# EAGLE design schematics (EAGLE 9.6.2)
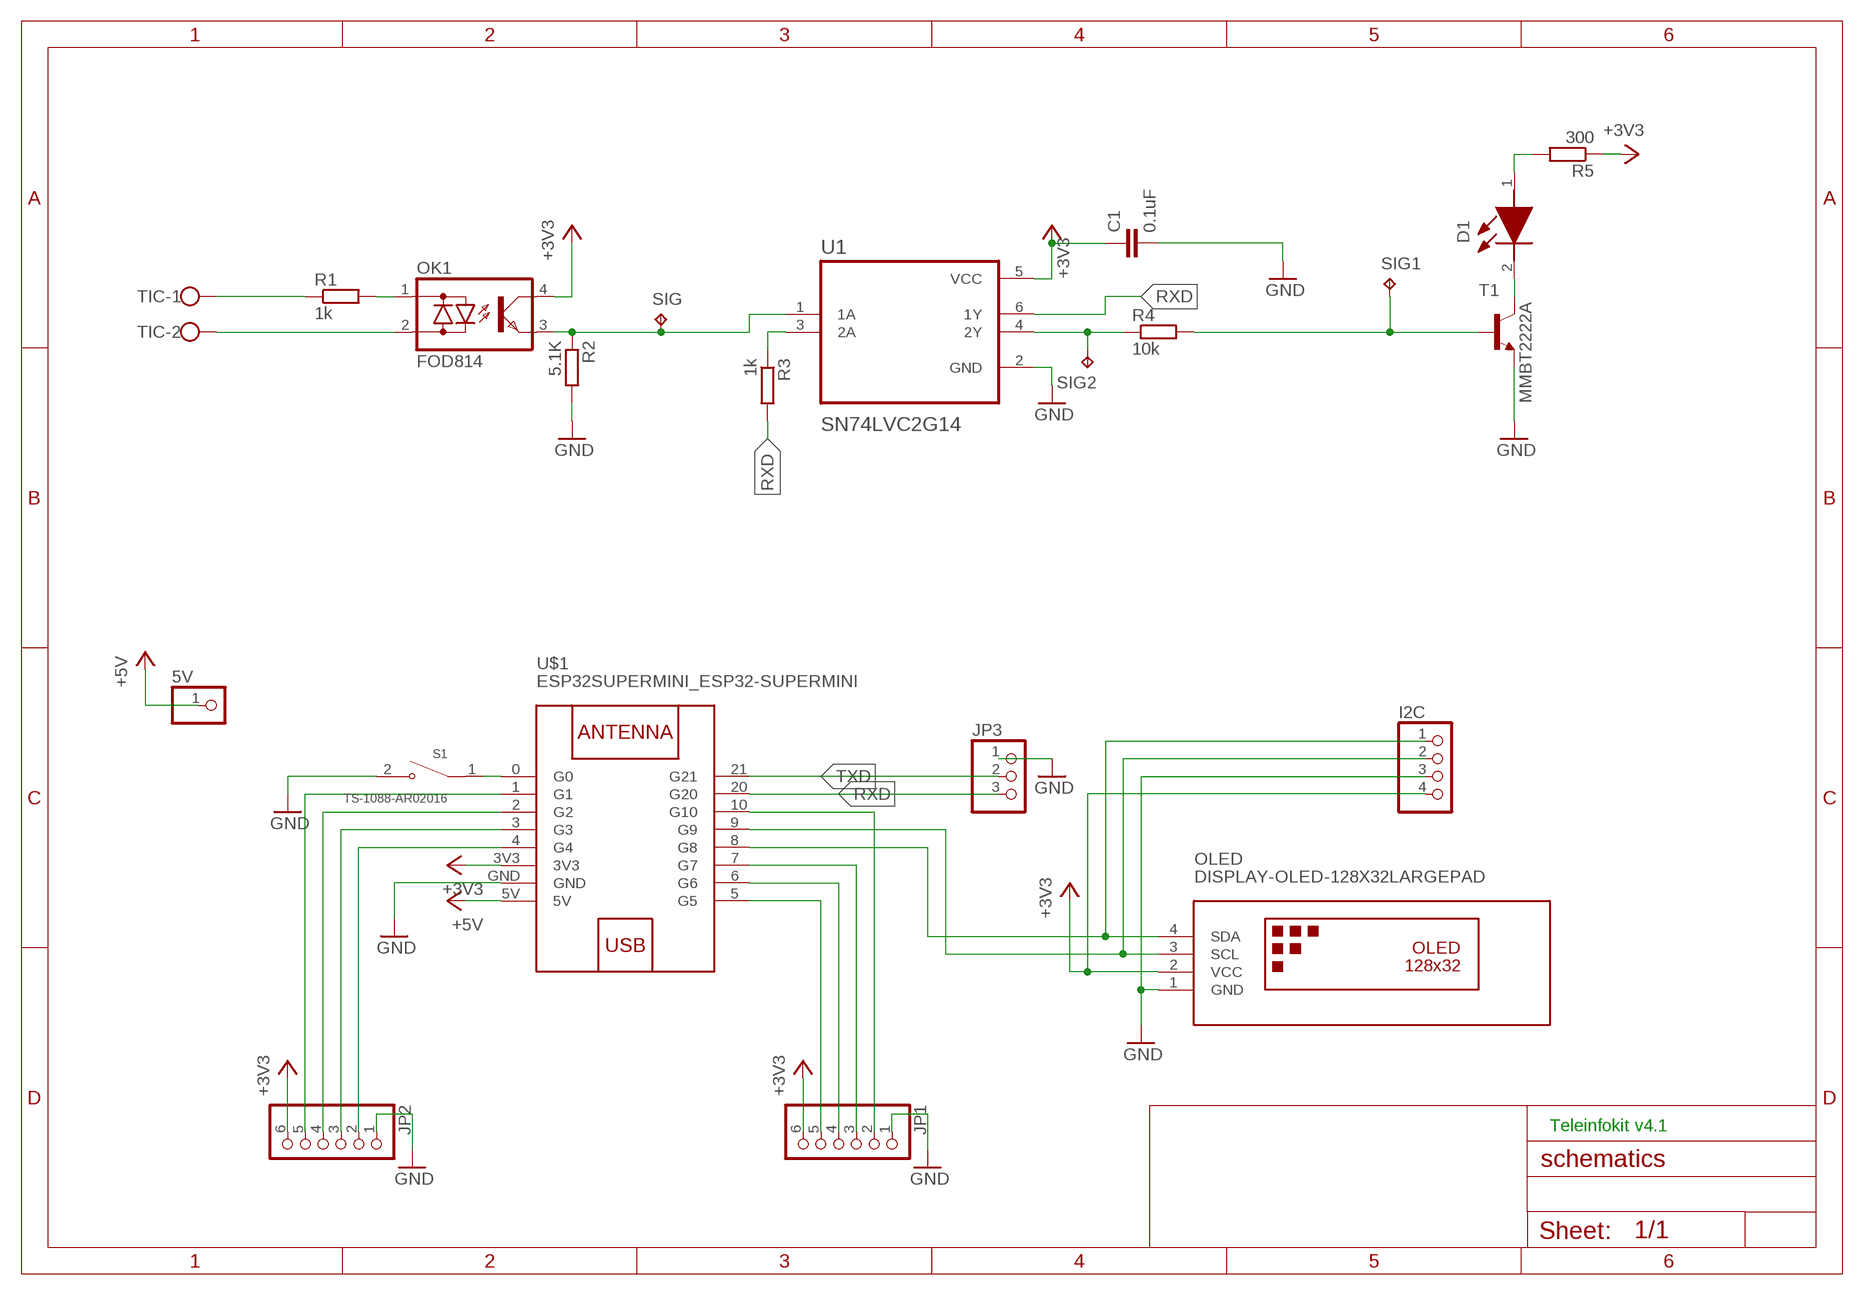
[diagram p0: schematic, sheet 1]

## Parts
5V  PINHD-1X1  [1X01]
C1  0.1uF  C-EUC0402K  [C0402K]
D1  17-21SURC_S530-A2_TR8  [1721SURCS530A2TR8]
I2C  PINHD-1X4ROUNDLARGE  [1X04ROUNDLARGE]
JP1  PINHD-1X6CB  [1X06-CLEANBIG]
JP2  PINHD-1X6CB  [1X06-CLEANBIG]
JP3  PINHD-1X3  [1X03]
OK1  FOD814  SFH6206  [DIL4-SMD]
OLED  DISPLAY-OLED-128X32LARGEPAD  [DISPLAY-OLED-128X32LARGE]
R1  1k  R-EU_R0805  [R0805]
R2  5.1K  R-EU_R0603  [R0603]
R3  1k  R-EU_R0805  [R0805]
R4  10k  R-EU_R0805  [R0805]
R5  300  R-EU_R0805  [R0805]
S1  TS-1088-AR02016  [SW_TS-1088-AR02016]
SIG  TPB1,27  [B1,27]
SIG1  TPB1,27  [B1,27]
SIG2  TPB1,27  [B1,27]
T1  MMBT2222A  MMBT2222ALT1-NPN-SOT23-BEC  [SOT23-BEC]
TIC  W237-102  [W237-102]
U1  SN74LVC2G14  SN74LVC2G14DBVR  [SOT95P280X145-6N]
U$1  ESP32SUPERMINI_ESP32-SUPERMINI  [ESP32SUPERMINI_ESP32-SUPERMINI]

## Nets
+3V3: C1.1 I2C.4 JP1.6 JP2.6 OK1.4(C) OLED.2(VCC) R5.1 U1.5(VCC) U$1.3V3
+5V: 5V.1 U$1.5V
GND: C1.2 I2C.3 JP1.1 JP2.1 JP3.1 OLED.1(GND) R2.2 S1.2 T1.E U1.2(GND) U$1.GND
N$1: OK1.1(AC1) R1.2
N$2: I2C.1 OLED.4(SDA) U$1.8(G8)
N$3: D1.1(A) R5.2
N$5: R4.1 SIG2.TP U1.4(2Y)
N$6: I2C.2 OLED.3(SCL) U$1.9(G9)
N$7: R1.1 TIC.1
N$8: OK1.2(AC2) TIC.2
N$10: JP1.5 U$1.5(G5)
N$11: OK1.3(E) R2.1 SIG.TP U1.1(1A)
N$12: D1.2(K) T1.C
N$13: R4.2 SIG1.TP T1.B
N$14: JP1.4 U$1.6(G6)
N$15: R3.1 U1.3(2A)
N$16: JP1.3 U$1.7(G7)
N$17: JP1.2 U$1.10(G10)
N$18: JP2.2 U$1.4(G4)
N$19: JP2.3 U$1.3(G3)
N$20: JP2.4 U$1.2(G2)
N$21: JP2.5 U$1.1(G1)
N$25: S1.1 U$1.0(G0)
RXD: JP3.3 R3.2 U1.6(1Y) U$1.20(G20)
TXD: JP3.2 U$1.21(G21)

## Notes on the sheet
- Teleinfokit v4.1

## Library data of the parts
5V = adafruit:PINHD-1X1: Pin header 1x1 for 0.1" spacing With round pins
C1 = rcl:C-EU: CAPACITOR, European symbol; LCSC_PART: C1525; SPICEPREFIX: C
D1 = 17-21SURC_S530-A2_TR8:17-21SURC_S530-A2_TR8: Standard LEDs - SMD 1.1mm Height Source: Datasheet <https://media.digikey.com/pdf/Data Sheets/Everlight PDFs/17-21SURC-S530-A2-TR8-V5~.pdf>; ARROW_PART_NUMBER: 17-21SURC/S530-A2/TR8; ARROW_PRICE-STOCK: https://www.arrow.com/en/products/17-21surcs530-a2tr8/everlight-electronics; DESCRIPTION: Standard LEDs - SMD 1.1mm Height; HEIGHT: mm; MANUFACTURER_NAME: Everlight; MANUFACTURER_PART_NUMBER: 17-21SURC/S530-A2/TR8; MOUSER_PART_NUMBER: N/A; MOUSER_PRICE-STOCK: https://www.mouser.co.uk/ProductDetail/Everlight/17-21SURC-S530-A2-TR8?qs=8cKuZ6Ok2lY9160apvjjyQ%3D%3D
I2C = pinhead-edit:PINHD-1X4: PIN HEADER
JP1 JP2 = adafruit:PINHD-1X6: PIN HEADER
JP3 = adafruit:PINHD-1X3: PIN HEADER
OK1 = optocoupler:SFH620: Optocoupler, Phototransistor Output, AC Input Source: http://www.vishay.com/docs/83675/sfh620.pdf; LCSC_PART: C479718; MF: VISHAY/TELEFUNKEN; MPN: SFH6206-3; OC_FARNELL: 1469585; OC_NEWARK: 58K2214
OLED = oled-edit:DISPLAY-OLED-128X32: 128x32 Dot Matrix OLED Module with I2C interface based on SSD1306 chip More details available here: http://www.tinyosshop.com/index.php?route=product/product&product_id=953 Schematic available here: http://www.tinyosshop.com/datasheet/OLED%2012832.pdf SSD1306 datasheet: https://cdn-shop.adafruit.com/datasheets/SSD1306.pdf Click here to find device on ebay.com <http://www.ebay.com/sch/oled+display+128x32+i2c>; LCSC_PART: C2718488
R1 = rcl:R-EU_: RESISTOR, European symbol; LCSC_PART: C17513; SPICEPREFIX: R
R2 = rcl:R-EU_: RESISTOR, European symbol; LCSC_PART: C23186; SPICEPREFIX: R
R3 R4 = rcl:R-EU_: RESISTOR, European symbol; LCSC_PART: C17414; SPICEPREFIX: R
R5 = rcl:R-EU_: RESISTOR, European symbol; LCSC_PART: C17617; SPICEPREFIX: R
S1 = TS-1088-AR02016:TS-1088-AR02016: Check availability <https://pricing.snapeda.com/parts/TS-1088-AR02016/Xunpu/view-part?ref=eda>; AVAILABILITY: Not in stock; CHECK_PRICES: https://www.snapeda.com/parts/TS-1088-AR02016/Xunpu/view-part/?ref=eda; DESCRIPTION: 50mA 4mm 100MΩ 100,000 Times 12V 160gf 3mm 2mm Round Button Vertical welding SPST SMD Tactile Switches ROHS; LCSC_PART: C720477; MF: Xunpu; MP: TS-1088-AR02016; PACKAGE: Package; PRICE: None; SNAPEDA_LINK: https://www.snapeda.com/parts/TS-1088-AR02016/Xunpu/view-part/?ref=snap
SIG SIG1 SIG2 = testpad:TP: Test pad
T1 = transistor:*-NPN-: NPN Transistror BF959 corrected 2008.03.06; LCSC_PART: C8512
TIC = con-wago-500:W237-102: WAGO SCREW CLAMP; MPN: 237-102; OC_FARNELL: unknown; OC_NEWARK: 70K9898
U1 = SN74LVC2G14DBVR:SN74LVC2G14DBVR: Check availability <https://pricing.snapeda.com/parts/SN74LVC2G14DBVR/Texas%20Instruments/view-part?ref=eda>; AVAILABILITY: In Stock; DESCRIPTION: 2-ch, 1.65-V to 5.5-V inverters with Schmitt-Trigger inputs; LCSC_PART: C12401; MF: Texas Instruments; MP: SN74LVC2G14DBVR; PACKAGE: SOT-23-6 Texas Instruments; PRICE: None; PURCHASE-URL: https://pricing.snapeda.com/search/part/SN74LVC2G14DBVR/?ref=eda
U$1 = ESP32C3supermini:ESP32SUPERMINI_ESP32-SUPERMINI: WEMOS D1 mini: Mini Wi-Fi Board based on ESP-8266 device More details can be found here: https://www.wemos.cc/product/d1-mini.html Click here to find device on ebay.com <http://www.ebay.com/sch/wemos+d1+mini+nodemcu>

## Board
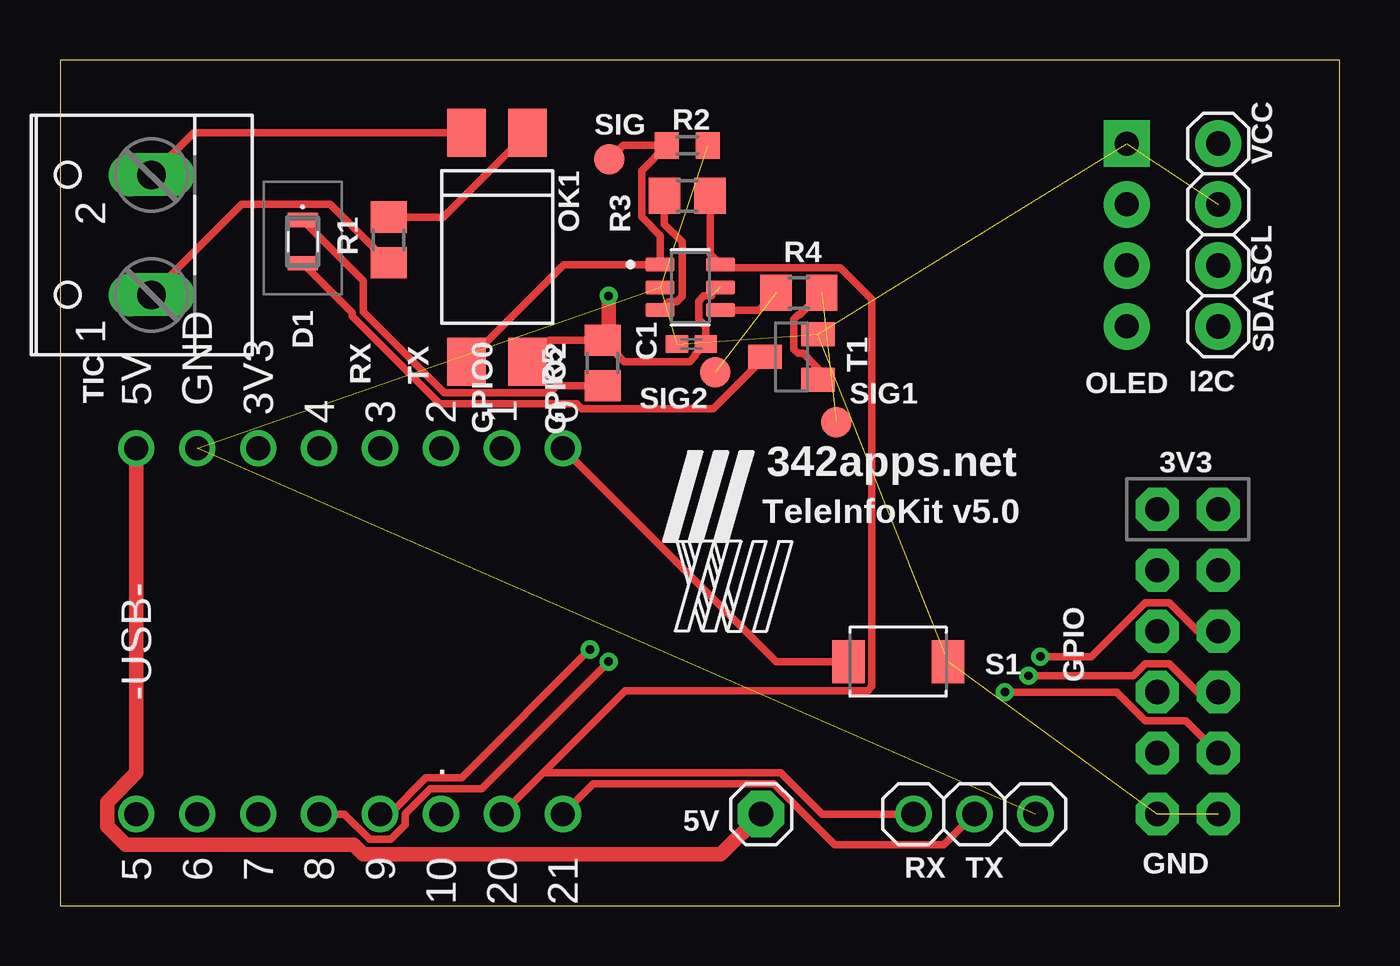
[diagram p1: board, top side]
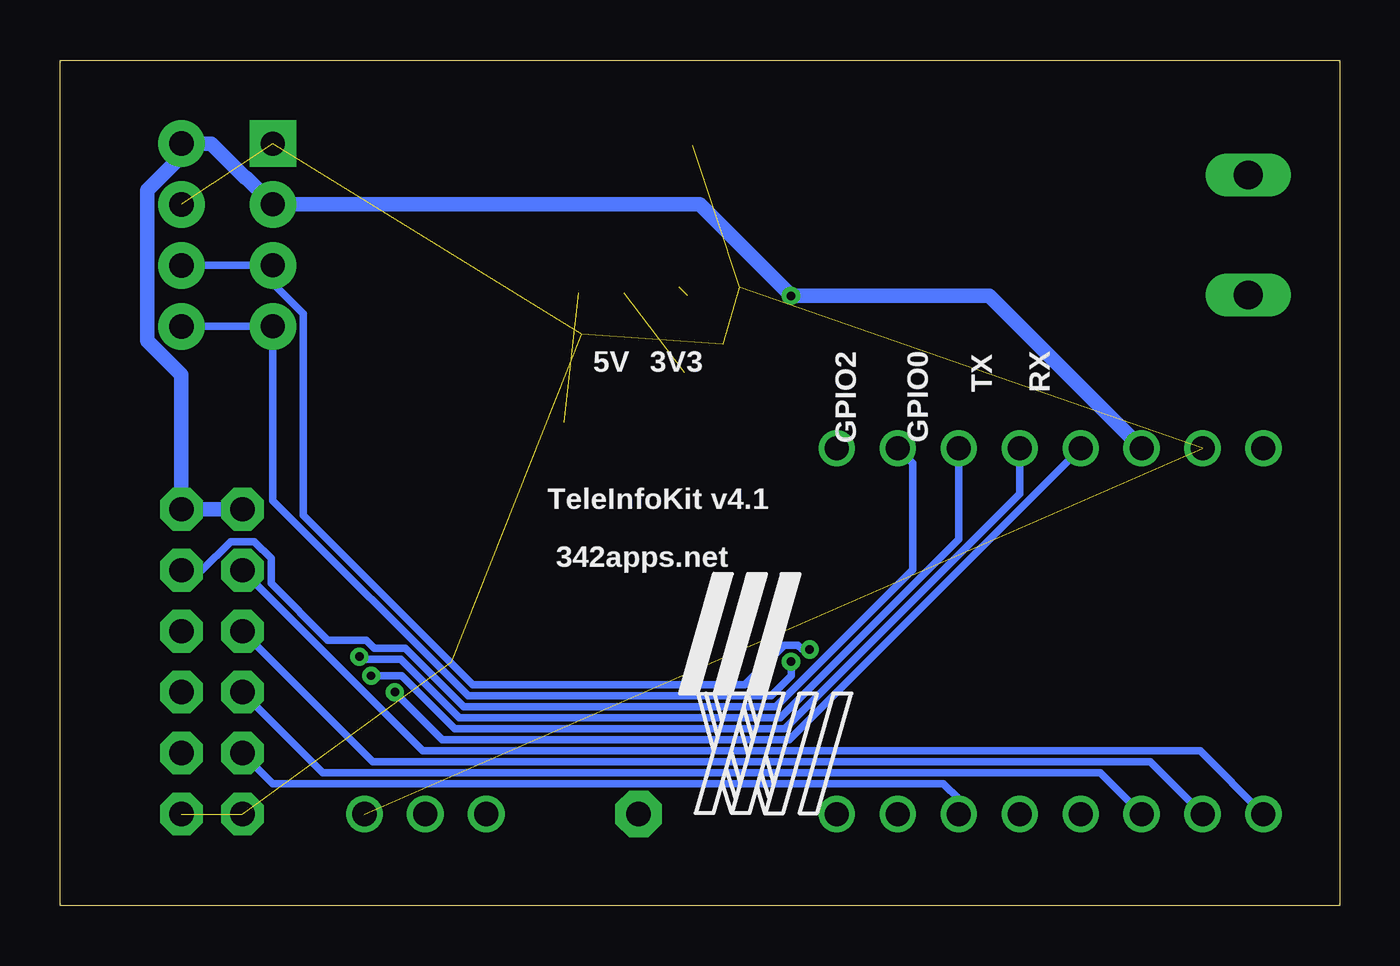
[diagram p2: board, bottom side, seen from below]

Size 53.32 x 35.23 mm. Coordinates in mm from the lower left corner, seen from the top.
Outline: 0,0 53.32,0 53.32,35.23 0,35.23 0,0
Copper layers (1*16): Top 0.035mm / dielectric 1.5mm / Bottom 0.035mm
Design rules "default *": minimum track width 6mil, minimum drill 0.35mm, track to track 6mil, track to pad 6mil, pad to pad 6mil, via to via 6mil, smd to smd 6mil, copper to edge 20mil, drill to drill 6mil, minimum pad ring 10mil, minimum via ring 8mil, stop-mask expansion 4mil, vias tented up to drill 0mil, thermal gap 10mil

### Footprints (pad centres in the part's own frame; a part is rotated, then mirrored left to right if it is on the bottom)
1X01 = drill 1.016 pad 1.93 octagon: 1 0,0
C0402K = smd 0.925 x 0.74: 1 -0.6,0; 2 0.6,0
1721SURCS530A2TR8 = smd 0.6 x 1.25: 1 0.9,0; 2 -0.9,0
1X04ROUNDLARGE = drill 1.016 pad 1.93: 1 -3.81,0; 2 -1.27,0; 3 1.27,0; 4 3.81,0
1X06-CLEANBIG = drill 1.016 pad 1.778 octagon: 1 -6.35,0; 2 -3.81,0; 3 -1.27,0; 4 1.27,0; 5 3.81,0; 6 6.35,0
1X03 = drill 1.016: 1 -2.54,0; 2 0,0; 3 2.54,0
DIL4-SMD = smd 1.6 x 2: 1 -1.27,-4.77; 2 1.27,-4.77; 3 1.27,4.77; 4 -1.27,4.77
DISPLAY-OLED-128X32LARGE = drill 1 pad 1.93 square: 1 -17.78,-3.81 | drill 1 pad 1.93: 2 -17.78,-1.27; 3 -17.78,1.27; 4 -17.78,3.81
R0805 = smd 1.3 x 1.5: 1 -0.95,0; 2 0.95,0
R0603 = smd 1 x 1.1: 1 -0.85,0; 2 0.85,0
SW_TS-1088-AR02016 = smd 1.35 x 1.8: 1 -2.075,0; 2 2.075,0
B1,27 = smd 1.27 x 1.27: TP 0,0
SOT23-BEC = smd 1 x 1.4: B -0.95,-1.1; C 0,1.1; E 0.95,-1.1
W237-102 = drill 1.194 long: 1 -2.5,-1.27; 2 2.5,-1.27
SOT95P280X145-6N = smd 1.21 x 0.58: 1 -1.255,0.95; 2 -1.255,0; 3 -1.255,-0.95; 4 1.255,-0.95; 5 1.255,0; 6 1.255,0.95
ESP32SUPERMINI_ESP32-SUPERMINI = drill 1: 0 -11.43,9.525; 1 -11.43,6.985; 2 -11.43,4.445; 3 -11.43,1.905; 3V3 -11.43,-3.175; 4 -11.43,-0.635; 5 3.81,-8.255; 5V -11.43,-8.255; 6 3.81,-5.715; 7 3.81,-3.175; 8 3.81,-0.635; 9 3.81,1.905; 10 3.81,4.445; 20 3.81,6.985; 21 3.81,9.525; GND -11.43,-5.715

### Placement (x,y rotation side)
5V  29.21,3.81 0 top
C1  26.3,23.39 180 top
D1  10.11,27.66 90 top
I2C  48.26,27.94 90 top
JP1  45.72,10.16 90 top
JP2  48.26,10.16 90 top
JP3  38.1,3.81 180 top
OK1  18.21,27.43 180 top
OLED  26.67,27.94 180 top
R1  13.69,27.74 90 top
R2  26.14,31.67 0 top
R3  26.14,29.57 0 top
R4  30.78,25.53 0 top
R5  22.61,22.61 270 top
S1  34.92,10.16 0 top
SIG  22.89,31.09 0 top
SIG1  32.33,20.14 90 top
SIG2  27.3,22.23 0 top
T1  30.48,22.86 90 top
TIC  2.54,27.94 90 top
U1  26.26,25.76 0 top
U$1  11.43,7.62 270 top

### Tracks (layer width: path | path; a pad name or v marks a point on that pad's centre or on a via)
+3V3  (via drill 0.35)  (1 unrouted)
  Top 0.305: 27.16,25.4 26.83,25.4 26.61,25.18 26.61,24.43 26.91,24.14 C1.1 26.47,22.96 26.47,22.9 26.24,22.66 23.5,22.66 R5.1 20.38,23.56 OK1.4
  Top 0.61: v22.86,25.4 22.86,23.81 R5.1
  Bottom 0.61: U$1.3V3 14.61,25.4 v22.86,25.4 26.67,29.21 OLED.2 45.57,30.33 45.6,30.33 47.03,31.75 I2C.4 48.26,31.22 49.68,29.8 49.68,23.54 48.26,22.12 JP2.6 JP1.6
+5V
  Top 0.61: U$1.5V 3.17,5.52 1.96,4.31 1.96,3.31 2.73,2.54 12.25,2.54 12.64,2.14 27.54,2.14 5V.1
GND  (10 unrouted)
N$1
  Top 0.305: R1.2 15.97,28.69 OK1.1
N$2  (via drill 0.35)
  Top 0.305: v22.86,10.16 17.57,4.87 15.44,4.87 14.39,3.83 14.39,3.37 13.77,2.75 12.9,2.75 11.84,3.81 U$1.8
  Bottom 0.305: I2C.1 OLED.4 44.45,16.88 36.31,8.74 23.69,8.74 22.86,9.57 v22.86,10.16
N$3
  Top 0.305: D1.1 12.64,26.03 12.64,24.74 16.02,21.36 20.41,21.36 20.71,21.66 R5.2
N$5  (1 unrouted)
  Top 0.305: R4.1 29.11,24.81 U1.4
N$6  (via drill 0.35)
  Top 0.305: v22.08,10.67 16.74,5.33 15.25,5.33 13.73,3.81 U$1.9
  Bottom 0.305: I2C.2 OLED.3 44.45,25.93 43.18,24.66 43.18,16.25 36.12,9.2 24.79,9.2 23.14,10.84 22.58,10.84 22.4,10.67 v22.08,10.67
N$7
  Top 0.305: TIC.1 7.58,29.21 11.27,29.21 R1.1
N$8
  Top 0.305: TIC.2 5.57,32.2 OK1.2
N$10
  Bottom 0.305: JP1.5 38.2,6.45 5.82,6.45 U$1.5
N$11
  Top 0.305: OK1.3 20.98,26.71 U1.1 25.01,27.91 24.23,28.69 24.23,30.62 R2.1 23.47,31.67 SIG.TP
N$12
  Top 0.305: D1.2 12.18,24.69 12.18,24.55 15.83,20.9 21.53,20.9 21.73,20.7 27.22,20.7 T1.C
N$13  (1 unrouted)
  Top 0.305: R4.2 30.82,24.61 30.75,24.61 30.57,24.44 30.57,23.18 30.75,23 30.97,23 31.58,22.39 T1.B
N$14
  Bottom 0.305: JP1.4 40.28,5.99 7.9,5.99 U$1.6
N$15
  Top 0.305: R3.1 25.19,28.38 25.92,27.65 25.92,25.38 25.7,25.16 25.36,25.16 U1.3
N$16
  Bottom 0.305: JP1.3 42.37,5.54 9.98,5.54 U$1.7
N$17
  Bottom 0.305: JP1.2 44.45,5.08 16.51,5.08 15.88,4.45 U$1.10
N$18  (via drill 0.35)
  Top 0.305: v39.37,8.89 44.03,8.89 45.23,7.7 46.91,7.7 JP2.2
  Bottom 0.305: U$1.4 22.94,6.91 37.39,6.91 v39.37,8.89
N$19  (via drill 0.35)
  Top 0.305: JP2.3 47.41,8.89 46.21,10.08 45.23,10.08 44.72,9.57 v40.36,9.57
  Bottom 0.305: U$1.3 13.34,17.16 23.13,7.37 36.88,7.37 39.09,9.57 v40.36,9.57
N$20  (via drill 0.35)
  Top 0.305: v40.85,10.37 42.97,10.37 45.23,12.62 46.21,12.62 47.41,11.43 JP2.4
  Bottom 0.305: U$1.2 15.88,15.26 23.32,7.82 36.69,7.82 39.12,10.26 40.74,10.26 v40.85,10.37
N$21
  Bottom 0.305: U$1.1 17.8,18.43 17.8,13.99 23.5,8.28 36.5,8.28 38.93,10.71 40.23,10.71 40.56,11.05 42.15,11.05 44.53,13.42 44.53,14.46 45.23,15.16 46.21,15.16 47.41,13.97 JP2.5
N$25
  Top 0.305: S1.1 29.84,10.16 U$1.0
RXD
  Top 0.305: R3.2 27.09,27.14 U1.6 27.64,26.58 32.51,26.58 33.83,25.26 33.83,9.13 33.65,8.96 23.56,8.96 U$1.20 20.14,5.54 30.02,5.54 31.75,3.81 JP3.3
TXD
  Top 0.305: U$1.21 22.23,5.08 29.74,5.08 32.28,2.54 36.83,2.54 JP3.2

### Text on the board
tNames: VCC | SCL | SDA | RX | TX | GPIO0 | GPIO2 | 342apps.net | 3V3 | TeleInfoKit v5.0 | GPIO | . | GND | RX | TX
bNames: RX | TX | GPIO0 | GPIO2 | 3V3 | 5V | TeleInfoKit v4.1 | 342apps.net